# Altium schematic sheet 幻彩灯带.SchDoc
size A4
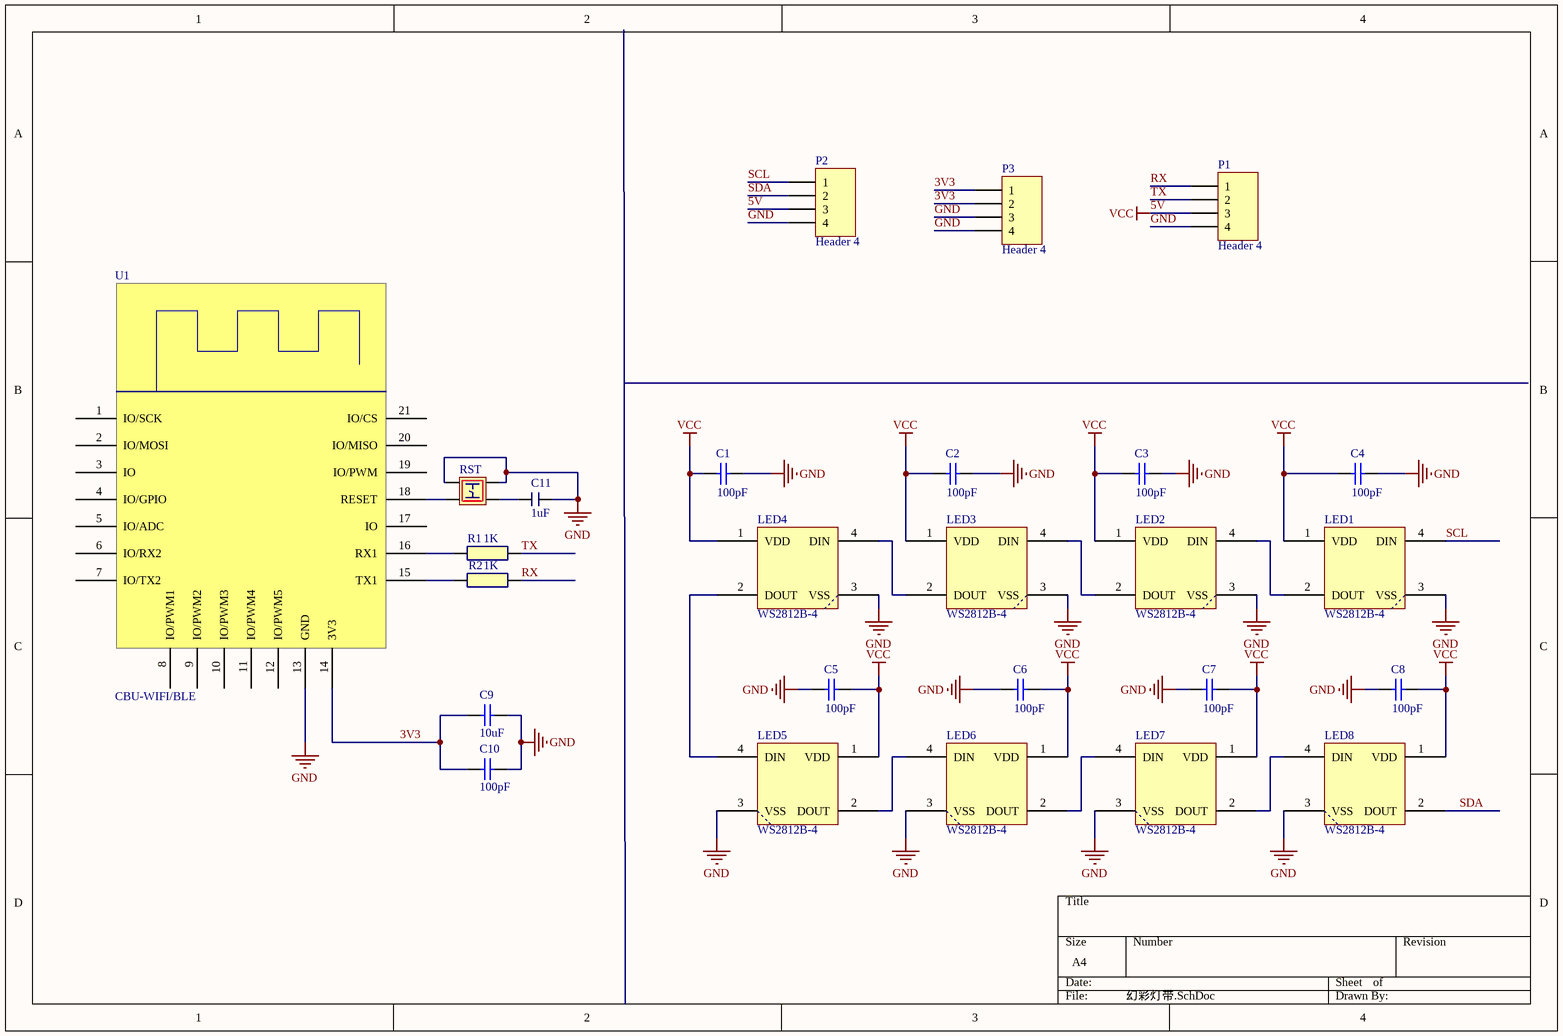
[diagram p0: 幻彩灯带.SchDoc]

## Parts
C1  value 100pF  [6-0805_N]  (hidden comment: 0.1uF)
C2  value 100pF  [6-0805_N]  (hidden comment: Cap)
C3  value 100pF  [6-0805_N]  (hidden comment: Cap)
C4  value 100pF  [6-0805_N]  (hidden comment: Cap)
C5  value 100pF  [6-0805_N]  (hidden comment: 0.1uF)
C6  value 100pF  [6-0805_N]  (hidden comment: 0.1uF)
C7  value 100pF  [6-0805_N]  (hidden comment: 0.1uF)
C8  value 100pF  [6-0805_N]  (hidden comment: 0.1uF)
C9  10uF  [6-0805_N]
C10  100pF  [6-0805_N]
C11  1uF  [C 0805_L]
LED1  WS2812B-4  [LED]
LED2  WS2812B-4  [LED]
LED3  WS2812B-4  [LED]
LED4  WS2812B-4  [LED]
LED5  WS2812B-4  [LED]
LED6  WS2812B-4  [LED]
LED7  WS2812B-4  [LED]
LED8  WS2812B-4  [LED]
P1  Header 4  [HDR1X4]
P2  Header 4  [HDR1X4]
P3  Header 4  [HDR1X4]
R1  1K  [R 0805_M]
R2  1K  [R 0805_M]
RST  BUTTON  [BUTTON6*6]  (value not drawn)
U1  CBU-WIFI/BLE  [CBU]

## Nets
5V: C1.1 C2.1 C3.1 C4.1 C5.2 C6.2 C7.2 C8.2 LED1.1(VDD) LED2.1(VDD) LED3.1(VDD) LED4.1(VDD) LED5.1(VDD) LED6.1(VDD) LED7.1(VDD) LED8.1(VDD) P1.3 P2.3  [also labelled VCC]
GND: C1.2 C2.2 C3.2 C4.2 C5.1 C6.1 C7.1 C8.1 C9.2 C10.2 C11.2 LED1.3(VSS) LED2.3(VSS) LED3.3(VSS) LED4.3(VSS) LED5.3(VSS) LED6.3(VSS) LED7.3(VSS) LED8.3(VSS) P1.4 P2.4 P3.3 P3.4 RST.1 U1.13(GND)
3V3: C9.1 C10.1 P3.1 P3.2 U1.14(3V3)
RX: P1.1 R2.2
SCL: LED1.4(DIN) P2.1
SDA: LED8.2(DOUT) P2.2
TX: P1.2 R1.2
NetC11_1: C11.1 RST.2
NetLED1_2: LED1.2(DOUT) LED2.4(DIN)
NetLED2_2: LED2.2(DOUT) LED3.4(DIN)
NetLED3_2: LED3.2(DOUT) LED4.4(DIN)
NetLED4_2: LED4.2(DOUT) LED5.4(DIN)
NetLED5_2: LED5.2(DOUT) LED6.4(DIN)
NetLED6_2: LED6.2(DOUT) LED7.4(DIN)
NetLED7_2: LED7.2(DOUT) LED8.4(DIN)
NetR1_1: R1.1 U1.16(RX1)
NetR2_1: R2.1 U1.15(TX1)
NetRST_2: RST.2 U1.18(RESET)

Not connected (* = marked no-connect by the designer): U1 1(IO/SCK) 2(IO/MOSI) 3(IO) 4(IO/GPIO) 5(IO/ADC) 6(IO/RX2) 7(IO/TX2) 8(IO/PWM1) 9(IO/PWM2) 10(IO/PWM3) 11(IO/PWM4) 12(IO/PWM5) 17(IO) 19(IO/PWM) 20(IO/MISO) 21(IO/CS)

## Library data of the parts
C1-C8 C10 = Cap: Capacitor; Published: 8-Jun-2000; LatestRevisionDate: 17-Jul-2002; LatestRevisionNote: Re-released for DXP Platform.; PackageReference: RAD-0.3; Publisher: Altium Limited; PackageDescription: Radial Cap, Thru-Hole; 2 Leads; 0.3 in Pin Spacing
  C10: Value: 100pF
C9 = Cap: Capacitor; Value: 100pF; Published: 8-Jun-2000; LatestRevisionDate: 17-Jul-2002; LatestRevisionNote: Re-released for DXP Platform.; PackageReference: RAD-0.3; Publisher: Altium Limited; PackageDescription: Radial Cap, Thru-Hole; 2 Leads; 0.3 in Pin Spacing
C11 = CAP
LED1-LED8 = LED
P1-P3 = Header 4: Header, 4-Pin; LatestRevisionDate: 17-Jul-2002; LatestRevisionNote: Re-released for DXP Platform.; Publisher: Altium Limited
R1 R2 = REGISTER